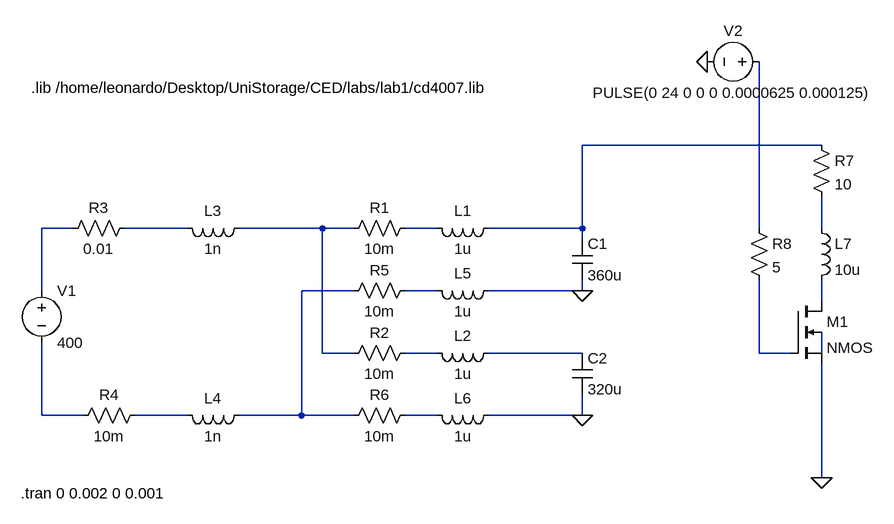
[diagram p0: schematic inverter-spice-nmos.asc]
inverter-spice-nmos.asc, the LTspice schematic file:
Version 4
SHEET 1 2308 680
WIRE 1248 -64 880 -64
WIRE 96 64 48 64
WIRE 272 64 176 64
WIRE 480 64 352 64
WIRE 528 64 480 64
WIRE 656 64 608 64
WIRE 880 64 880 -64
WIRE 880 64 736 64
WIRE 1152 64 1152 -192
WIRE 1248 64 1248 16
WIRE 880 80 880 64
WIRE 48 160 48 64
WIRE 528 160 448 160
WIRE 656 160 608 160
WIRE 880 160 880 144
WIRE 880 160 736 160
WIRE 1248 176 1248 144
WIRE 480 256 480 64
WIRE 528 256 480 256
WIRE 656 256 608 256
WIRE 880 256 736 256
WIRE 1152 256 1152 144
WIRE 1200 256 1152 256
WIRE 1248 256 1248 224
WIRE 48 352 48 240
WIRE 112 352 48 352
WIRE 272 352 192 352
WIRE 448 352 448 160
WIRE 448 352 352 352
WIRE 528 352 448 352
WIRE 656 352 608 352
WIRE 880 352 880 320
WIRE 880 352 736 352
WIRE 1248 448 1248 272
FLAG 1248 448 0
FLAG 1072 -192 0
FLAG 880 160 0
FLAG 880 352 0
SYMBOL voltage 48 144 R0
WINDOW 123 0 0 Left 0
WINDOW 39 0 0 Left 0
SYMATTR InstName V1
SYMATTR Value 400
SYMBOL res 192 48 R90
WINDOW 0 0 56 VBottom 2
WINDOW 3 32 56 VTop 2
SYMATTR InstName R3
SYMATTR Value 0.01
SYMBOL res 208 336 R90
WINDOW 0 0 56 VBottom 2
WINDOW 3 32 56 VTop 2
SYMATTR InstName R4
SYMATTR Value 10m
SYMBOL ind 368 48 R90
WINDOW 0 5 56 VBottom 2
WINDOW 3 32 56 VTop 2
SYMATTR InstName L3
SYMATTR Value 1n
SYMBOL ind 368 336 R90
WINDOW 0 5 56 VBottom 2
WINDOW 3 32 56 VTop 2
SYMATTR InstName L4
SYMATTR Value 1n
SYMBOL res 624 48 R90
WINDOW 0 0 56 VBottom 2
WINDOW 3 32 56 VTop 2
SYMATTR InstName R1
SYMATTR Value 10m
SYMBOL res 624 144 R90
WINDOW 0 0 56 VBottom 2
WINDOW 3 32 56 VTop 2
SYMATTR InstName R5
SYMATTR Value 10m
SYMBOL ind 752 48 R90
WINDOW 0 5 56 VBottom 2
WINDOW 3 32 56 VTop 2
SYMATTR InstName L1
SYMATTR Value 1u
SYMBOL ind 752 144 R90
WINDOW 0 5 56 VBottom 2
WINDOW 3 32 56 VTop 2
SYMATTR InstName L5
SYMATTR Value 1u
SYMBOL cap 864 80 R0
SYMATTR InstName C1
SYMATTR Value 360u
SYMBOL res 1232 -80 R0
SYMATTR InstName R7
SYMATTR Value 10
SYMBOL res 1136 48 R0
SYMATTR InstName R8
SYMATTR Value 5
SYMBOL ind 1232 48 R0
SYMATTR InstName L7
SYMATTR Value 10u
SYMBOL voltage 1168 -192 R90
WINDOW 0 -32 56 VBottom 2
WINDOW 3 32 56 VTop 2
WINDOW 123 0 0 Left 0
WINDOW 39 0 0 Left 0
SYMATTR InstName V2
SYMATTR Value PULSE(0 24 0 0 0 0.0000625 0.000125)
SYMBOL nmos4 1200 176 R0
SYMATTR InstName M1
SYMATTR Value2 L=5u W=170u Ad=8500p As=8500p Pd=440u Ps=440u NRD=0.1 NRS=0.1
SYMBOL res 624 240 R90
WINDOW 0 0 56 VBottom 2
WINDOW 3 32 56 VTop 2
SYMATTR InstName R2
SYMATTR Value 10m
SYMBOL res 624 336 R90
WINDOW 0 0 56 VBottom 2
WINDOW 3 32 56 VTop 2
SYMATTR InstName R6
SYMATTR Value 10m
SYMBOL ind 752 240 R90
WINDOW 0 5 56 VBottom 2
WINDOW 3 32 56 VTop 2
SYMATTR InstName L2
SYMATTR Value 1u
SYMBOL ind 752 336 R90
WINDOW 0 5 56 VBottom 2
WINDOW 3 32 56 VTop 2
SYMATTR InstName L6
SYMATTR Value 1u
SYMBOL cap 864 256 R0
SYMATTR InstName C2
SYMATTR Value 320u
TEXT 16 472 Left 2 !.tran 0 0.002 0 0.001
TEXT 32 -152 Left 2 !.lib /home/leonardo/Desktop/UniStorage/CED/labs/lab1/cd4007.lib

The netlist it stands for:
* inverter-spice-nmos.asc
V1 N002 N015 400
R3 N003 N002 0.01
R4 N016 N015 10m
L3 N004 N003 1n
L4 N008 N016 1n
R1 N005 N004 10m
R5 N009 N008 10m
L1 N001 N005 1u
L5 0 N009 1u
C1 N001 0 360u
R7 N001 N007 10
R8 N006 N013 5
L7 N007 N010 10u
V2 N006 0 PULSE(0 24 0 0 0 0.0000625 0.000125)
M1 N010 N013 0 N014 NMOS L=5u W=170u Ad=8500p As=8500p Pd=440u Ps=440u NRD=0.1 NRS=0.1
R2 N011 N004 10m
R6 N017 N008 10m
L2 N012 N011 1u
L6 0 N017 1u
C2 N012 0 320u
.model NMOS NMOS
.model PMOS PMOS
.lib standard.mos
.tran 0 0.002 0 0.001
.lib /home/leonardo/Desktop/UniStorage/CED/labs/lab1/cd4007.lib
.backanno
.end